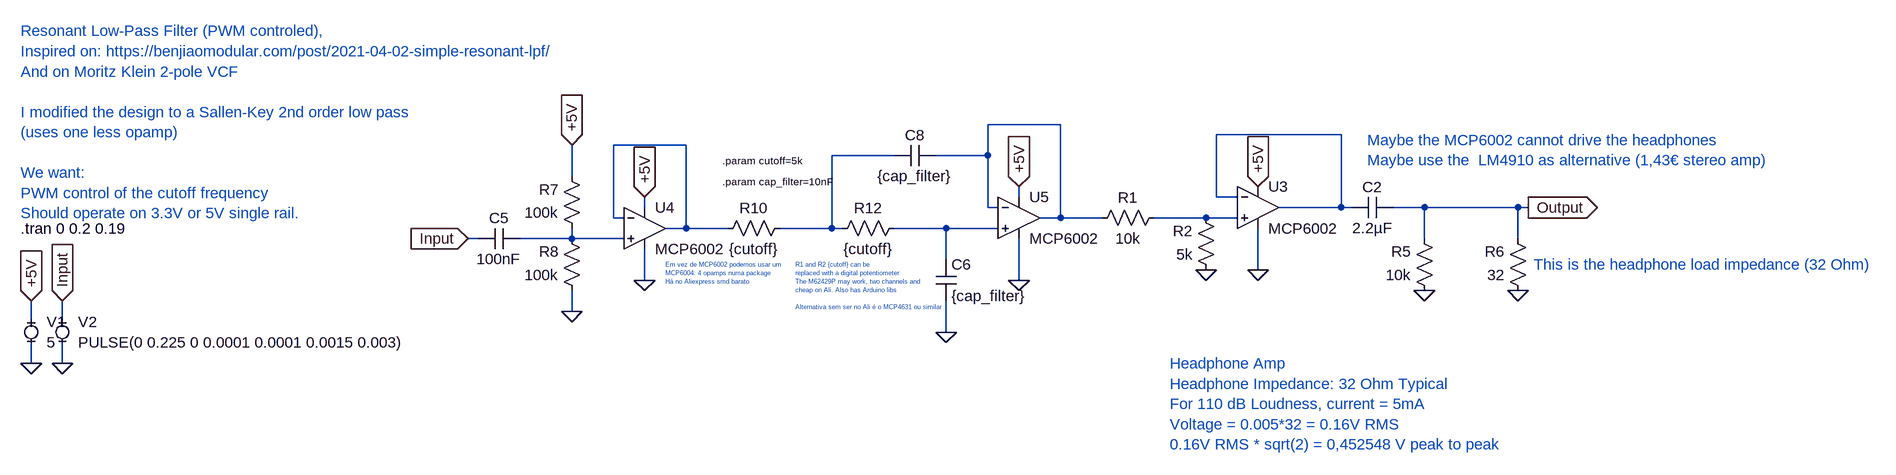
[diagram p0: schematic Low-Pass_Filter.asc]
Low-Pass_Filter.asc, the LTspice schematic file:
Version 4
SHEET 1 3000 1092
WIRE 1456 192 1344 192
WIRE 1888 208 1696 208
WIRE 880 224 768 224
WIRE 1200 240 1104 240
WIRE 1344 240 1344 192
WIRE 1344 240 1264 240
WIRE 704 272 704 224
WIRE 1392 304 1392 288
WIRE 1696 304 1696 208
WIRE 1728 304 1696 304
WIRE 816 320 816 304
WIRE 1344 320 1344 240
WIRE 1360 320 1344 320
WIRE 1888 320 1888 208
WIRE 1888 320 1792 320
WIRE 1904 320 1888 320
WIRE 2016 320 1968 320
WIRE 2160 320 2016 320
WIRE 2176 320 2160 320
WIRE 768 336 768 224
WIRE 784 336 768 336
WIRE 1456 336 1456 192
WIRE 1456 336 1424 336
WIRE 1520 336 1456 336
WIRE 1680 336 1600 336
WIRE 1728 336 1680 336
WIRE 880 352 880 224
WIRE 880 352 848 352
WIRE 944 352 880 352
WIRE 1104 352 1104 240
WIRE 1104 352 1024 352
WIRE 1120 352 1104 352
WIRE 1280 352 1200 352
WIRE 1360 352 1280 352
WIRE 560 368 544 368
WIRE 704 368 704 352
WIRE 704 368 624 368
WIRE 784 368 704 368
WIRE 2016 368 2016 320
WIRE 2160 368 2160 320
WIRE 1280 400 1280 352
WIRE 1760 416 1760 352
WIRE 816 432 816 384
WIRE 1392 432 1392 368
WIRE 704 480 704 448
WIRE -128 496 -128 464
WIRE -80 496 -80 464
WIRE 1280 512 1280 464
WIRE -128 560 -128 528
WIRE -80 560 -80 528
FLAG -128 560 0
FLAG -80 560 0
FLAG -80 464 Input
IOPIN -80 464 In
FLAG -128 464 +5V
IOPIN -128 464 In
FLAG 816 432 0
FLAG 704 480 0
FLAG 544 368 Input
IOPIN 544 368 In
FLAG 704 224 +5V
IOPIN 704 224 In
FLAG 816 304 +5V
IOPIN 816 304 In
FLAG 1280 512 0
FLAG 1392 432 0
FLAG 1392 288 +5V
IOPIN 1392 288 In
FLAG 1760 288 +5V
IOPIN 1760 288 In
FLAG 1760 416 0
FLAG 2176 320 Output
IOPIN 2176 320 Out
FLAG 2016 448 0
FLAG 1680 416 0
FLAG 2160 448 0
SYMBOL MiniSyms4\\voltage- -128 512 R0
WINDOW 123 0 0 Left 0
WINDOW 39 0 0 Left 0
SYMATTR InstName V1
SYMATTR Value 5
SYMBOL MiniSyms4\\voltage- -80 512 R0
WINDOW 123 0 0 Left 0
WINDOW 39 0 0 Left 0
SYMATTR InstName V2
SYMATTR Value PULSE(0 0.225 0 0.0001 0.0001 0.0015 0.003)
SYMBOL OpAmp\\MCP6002 816 288 R0
SYMATTR InstName U4
SYMBOL res 720 368 R180
WINDOW 0 36 76 Left 2
WINDOW 3 36 40 Left 2
SYMATTR InstName R7
SYMATTR Value 100k
SYMBOL res 720 464 R180
WINDOW 0 36 76 Left 2
WINDOW 3 36 40 Left 2
SYMATTR InstName R8
SYMATTR Value 100k
SYMBOL cap 624 352 R90
WINDOW 0 0 32 VBottom 2
WINDOW 3 32 32 VTop 2
SYMATTR InstName C5
SYMATTR Value 100nF
SYMBOL cap 1264 400 R0
SYMATTR InstName C6
SYMATTR Value {cap_filter}
SYMBOL OpAmp\\MCP6002 1392 272 R0
SYMATTR InstName U5
SYMBOL res 1040 336 R90
WINDOW 0 0 56 VBottom 2
WINDOW 3 32 56 VTop 2
SYMATTR InstName R10
SYMATTR Value {cutoff}
SYMBOL res 1216 336 R90
WINDOW 0 0 56 VBottom 2
WINDOW 3 32 56 VTop 2
SYMATTR InstName R12
SYMATTR Value {cutoff}
SYMBOL cap 1264 224 R90
WINDOW 0 0 32 VBottom 2
WINDOW 3 32 32 VTop 2
SYMATTR InstName C8
SYMATTR Value {cap_filter}
SYMBOL OpAmp\\MCP6002 1760 256 R0
SYMATTR InstName U3
SYMBOL cap 1968 304 R90
WINDOW 0 0 32 VBottom 2
WINDOW 3 32 32 VTop 2
SYMATTR InstName C2
SYMATTR Value 2.2µF
SYMBOL res 2032 464 R180
WINDOW 0 36 76 Left 2
WINDOW 3 36 40 Left 2
SYMATTR InstName R5
SYMATTR Value 10k
SYMBOL res 1616 320 R90
WINDOW 0 0 56 VBottom 2
WINDOW 3 32 56 VTop 2
SYMATTR InstName R1
SYMATTR Value 10k
SYMBOL res 1696 432 R180
WINDOW 0 36 76 Left 2
WINDOW 3 36 40 Left 2
SYMATTR InstName R2
SYMATTR Value 5k
SYMBOL res 2176 464 R180
WINDOW 0 36 76 Left 2
WINDOW 3 36 40 Left 2
SYMATTR InstName R6
SYMATTR Value 32
TEXT -144 48 Left 2 ;Resonant Low-Pass Filter (PWM controled), \nInspired on: https://benjiaomodular.com/post/2021-04-02-simple-resonant-lpf/\nAnd on Moritz Klein 2-pole VCF\n \nI modified the design to a Sallen-Key 2nd order low pass \n(uses one less opamp)\n \nWe want:\nPWM control of the cutoff frequency \nShould operate on 3.3V or 5V single rail.
TEXT -144 352 Left 2 !.tran 0 0.2 0.19
TEXT 848 408 Left 0 ;Em vez de MCP6002 podemos usar um \nMCP6004: 4 opamps numa package\nHá no Aliexpress smd barato
TEXT 936 248 Left 1 !.param cutoff=5k
TEXT 936 280 Left 1 !.param cap_filter=10nF
TEXT 1048 408 Left 0 ;R1 and R2 {cutoff} can be \nreplaced with a digital potentiometer\nThe M62429P may work, two channels and\ncheap on Ali. Also has Arduino libs\n \nAlternativa sem ser no Ali é o MCP4631 ou similar
TEXT 1624 560 Left 2 ;Headphone Amp\nHeadphone Impedance: 32 Ohm Typical\nFor 110 dB Loudness, current = 5mA\nVoltage = 0.005*32 = 0.16V RMS\n0.16V RMS * sqrt(2) = 0,452548 V peak to peak
TEXT 1928 216 Left 2 ;Maybe the MCP6002 cannot drive the headphones\nMaybe use the  LM4910 as alternative (1,43€ stereo amp)
TEXT 2184 408 Left 2 ;This is the headphone load impedance (32 Ohm)

The netlist it stands for:
* Low-Pass_Filter.asc
V1 +5V 0 5
V2 Input 0 PULSE(0 0.225 0 0.0001 0.0001 0.0015 0.003)
* U4: MCP6002 (symbol OpAmp\MCP6002 not available, pins judged from their places): In+=N007 In-=N003 V+=+5V V-=0 OUT=N003
R7 N007 +5V 100k
R8 0 N007 100k
C5 N007 Input 100nF
C6 N006 0 {cap_filter}
* U5: MCP6002 (symbol OpAmp\MCP6002 not available, pins judged from their places): In+=N006 In-=N001 V+=+5V V-=0 OUT=N001
R10 N004 N003 {cutoff}
R12 N006 N004 {cutoff}
C8 N001 N004 {cap_filter}
* U3: MCP6002 (symbol OpAmp\MCP6002 not available, pins judged from their places): In+=N005 In-=N002 V+=+5V V-=0 OUT=N002
C2 Output N002 2.2µF
R5 0 Output 10k
R1 N005 N001 10k
R2 0 N005 5k
R6 0 Output 32
* Resonant Low-Pass Filter (PWM controled),
* Inspired on: https://benjiaomodular.com/post/2021-04-02-simple-resonant-lpf/
* And on Moritz Klein 2-pole VCF
* I modified the design to a Sallen-Key 2nd order low pass
* (uses one less opamp)
* We want:
* PWM control of the cutoff frequency
* Should operate on 3.3V or 5V single rail.
.tran 0 0.2 0.19
* Em vez de MCP6002 podemos usar um
* MCP6004: 4 opamps numa package
* Há no Aliexpress smd barato
.param cutoff=5k
.param cap_filter=10nF
* R1 and R2 {cutoff} can be
* replaced with a digital potentiometer
* The M62429P may work, two channels and
* cheap on Ali. Also has Arduino libs
* Alternativa sem ser no Ali é o MCP4631 ou similar
* Headphone Amp
* Headphone Impedance: 32 Ohm Typical
* For 110 dB Loudness, current = 5mA
* Voltage = 0.005*32 = 0.16V RMS
* 0.16V RMS * sqrt(2) = 0,452548 V peak to peak
* Maybe the MCP6002 cannot drive the headphones
* Maybe use the  LM4910 as alternative (1,43€ stereo amp)
* This is the headphone load impedance (32 Ohm)
.backanno
.end